# Altium project dsd_badge.PrjPCB
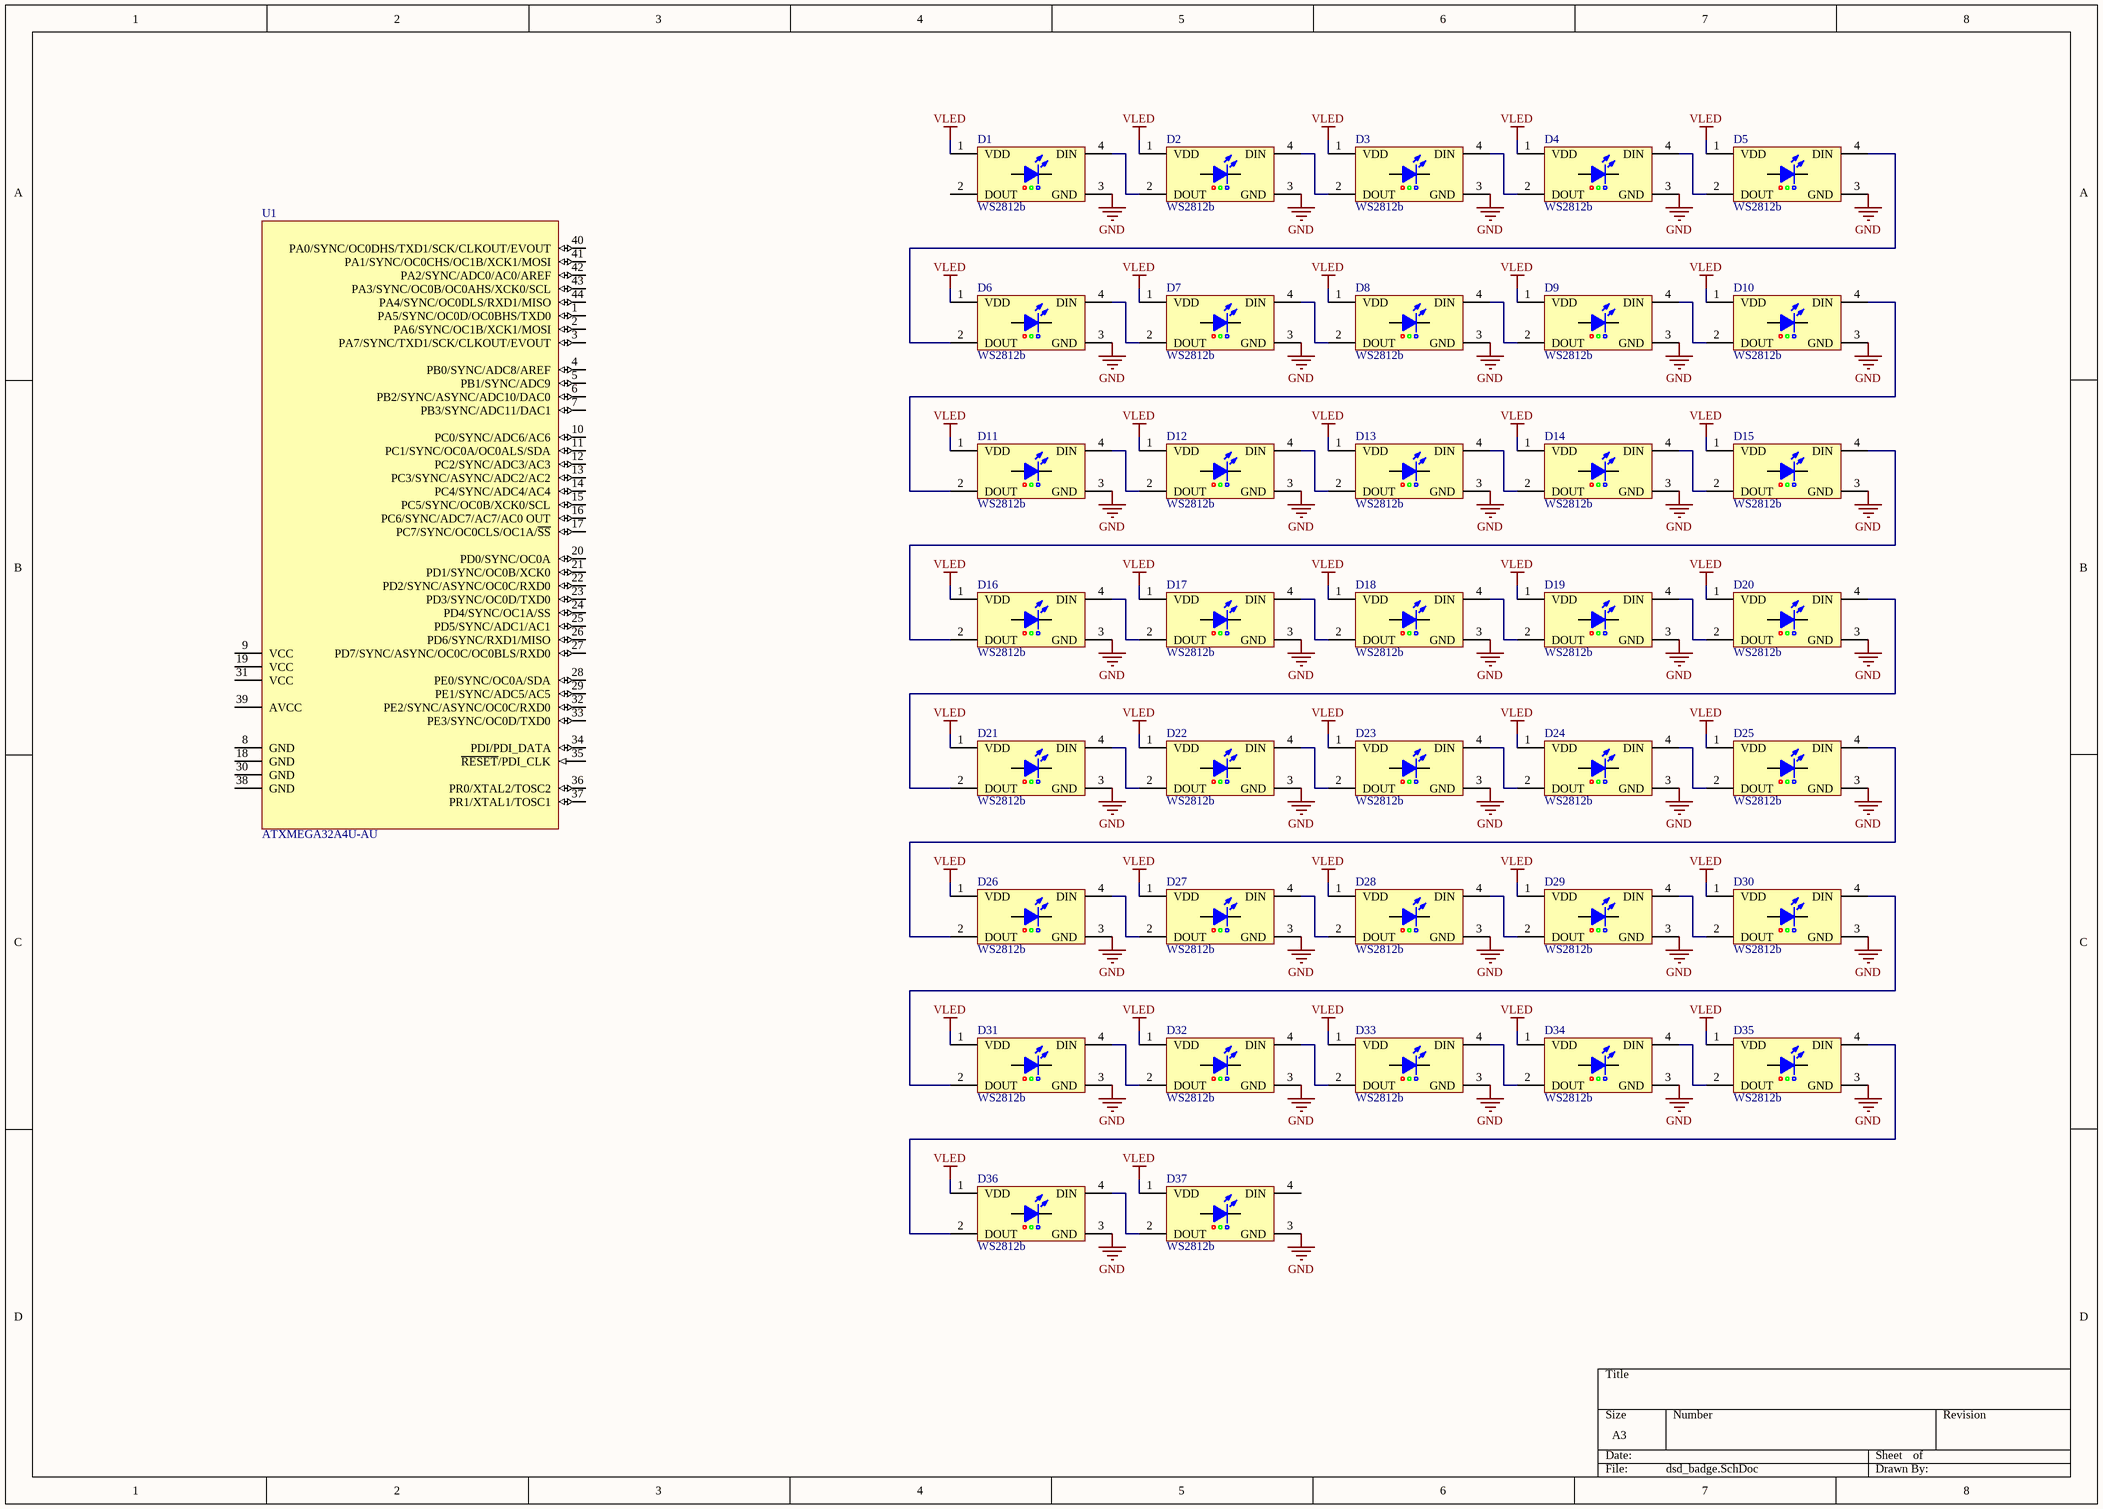
[diagram p0: dsd_badge.SchDoc]
1 sheet, 38 parts. Net scope: global (net labels, ports and power ports of the same name join across sheets).
Board file: DSD_Badge.PcbDoc

## Sheet dsd_badge.SchDoc
size A3

### Parts
D1  WS2812b  [WS2812B]
D2  WS2812b  [WS2812B]
D3  WS2812b  [WS2812B]
D4  WS2812b  [WS2812B]
D5  WS2812b  [WS2812B]
D6  WS2812b  [WS2812B]
D7  WS2812b  [WS2812B]
D8  WS2812b  [WS2812B]
D9  WS2812b  [WS2812B]
D10  WS2812b  [WS2812B]
D11  WS2812b  [WS2812B]
D12  WS2812b  [WS2812B]
D13  WS2812b  [WS2812B]
D14  WS2812b  [WS2812B]
D15  WS2812b  [WS2812B]
D16  WS2812b  [WS2812B]
D17  WS2812b  [WS2812B]
D18  WS2812b  [WS2812B]
D19  WS2812b  [WS2812B]
D20  WS2812b  [WS2812B]
D21  WS2812b  [WS2812B]
D22  WS2812b  [WS2812B]
D23  WS2812b  [WS2812B]
D24  WS2812b  [WS2812B]
D25  WS2812b  [WS2812B]
D26  WS2812b  [WS2812B]
D27  WS2812b  [WS2812B]
D28  WS2812b  [WS2812B]
D29  WS2812b  [WS2812B]
D30  WS2812b  [WS2812B]
D31  WS2812b  [WS2812B]
D32  WS2812b  [WS2812B]
D33  WS2812b  [WS2812B]
D34  WS2812b  [WS2812B]
D35  WS2812b  [WS2812B]
D36  WS2812b  [WS2812B]
D37  WS2812b  [WS2812B]
U1  ATXMEGA32A4U-AU  [44A_L]

### Nets
GND: D1.3(GND) D2.3(GND) D3.3(GND) D4.3(GND) D5.3(GND) D6.3(GND) D7.3(GND) D8.3(GND) D9.3(GND) D10.3(GND) D11.3(GND) D12.3(GND) D13.3(GND) D14.3(GND) D15.3(GND) D16.3(GND) D17.3(GND) D18.3(GND) D19.3(GND) D20.3(GND) D21.3(GND) D22.3(GND) D23.3(GND) D24.3(GND) D25.3(GND) D26.3(GND) D27.3(GND) D28.3(GND) D29.3(GND) D30.3(GND) D31.3(GND) D32.3(GND) D33.3(GND) D34.3(GND) D35.3(GND) D36.3(GND) D37.3(GND)
VLED: D1.1(VDD) D2.1(VDD) D3.1(VDD) D4.1(VDD) D5.1(VDD) D6.1(VDD) D7.1(VDD) D8.1(VDD) D9.1(VDD) D10.1(VDD) D11.1(VDD) D12.1(VDD) D13.1(VDD) D14.1(VDD) D15.1(VDD) D16.1(VDD) D17.1(VDD) D18.1(VDD) D19.1(VDD) D20.1(VDD) D21.1(VDD) D22.1(VDD) D23.1(VDD) D24.1(VDD) D25.1(VDD) D26.1(VDD) D27.1(VDD) D28.1(VDD) D29.1(VDD) D30.1(VDD) D31.1(VDD) D32.1(VDD) D33.1(VDD) D34.1(VDD) D35.1(VDD) D36.1(VDD) D37.1(VDD)
NetD1_4: D1.4(DIN) D2.2(DOUT)
NetD2_4: D2.4(DIN) D3.2(DOUT)
NetD3_4: D3.4(DIN) D4.2(DOUT)
NetD4_4: D4.4(DIN) D5.2(DOUT)
NetD5_4: D5.4(DIN) D6.2(DOUT)
NetD6_4: D6.4(DIN) D7.2(DOUT)
NetD7_4: D7.4(DIN) D8.2(DOUT)
NetD8_4: D8.4(DIN) D9.2(DOUT)
NetD9_4: D9.4(DIN) D10.2(DOUT)
NetD10_4: D10.4(DIN) D11.2(DOUT)
NetD11_4: D11.4(DIN) D12.2(DOUT)
NetD12_4: D12.4(DIN) D13.2(DOUT)
NetD13_4: D13.4(DIN) D14.2(DOUT)
NetD14_4: D14.4(DIN) D15.2(DOUT)
NetD15_4: D15.4(DIN) D16.2(DOUT)
NetD16_4: D16.4(DIN) D17.2(DOUT)
NetD17_4: D17.4(DIN) D18.2(DOUT)
NetD18_4: D18.4(DIN) D19.2(DOUT)
NetD19_4: D19.4(DIN) D20.2(DOUT)
NetD20_4: D20.4(DIN) D21.2(DOUT)
NetD21_4: D21.4(DIN) D22.2(DOUT)
NetD22_4: D22.4(DIN) D23.2(DOUT)
NetD23_4: D23.4(DIN) D24.2(DOUT)
NetD24_4: D24.4(DIN) D25.2(DOUT)
NetD25_4: D25.4(DIN) D26.2(DOUT)
NetD26_4: D26.4(DIN) D27.2(DOUT)
NetD27_4: D27.4(DIN) D28.2(DOUT)
NetD28_4: D28.4(DIN) D29.2(DOUT)
NetD29_4: D29.4(DIN) D30.2(DOUT)
NetD30_4: D30.4(DIN) D31.2(DOUT)
NetD31_4: D31.4(DIN) D32.2(DOUT)
NetD32_4: D32.4(DIN) D33.2(DOUT)
NetD33_4: D33.4(DIN) D34.2(DOUT)
NetD34_4: D34.4(DIN) D35.2(DOUT)
NetD35_4: D35.4(DIN) D36.2(DOUT)
NetD36_4: D36.4(DIN) D37.2(DOUT)

Not connected (* = marked no-connect by the designer): D1 2(DOUT); D37 4(DIN); U1 1(PA5/SYNC/OC0D/OC0BHS/TXD0) 2(PA6/SYNC/OC1B/XCK1/MOSI) 3(PA7/SYNC/TXD1/SCK/CLKOUT/EVOUT) 4(PB0/SYNC/ADC8/AREF) 5(PB1/SYNC/ADC9) 6(PB2/SYNC/ASYNC/ADC10/DAC0) 7(PB3/SYNC/ADC11/DAC1) 8(GND) 9(VCC) 10(PC0/SYNC/ADC6/AC6) 11(PC1/SYNC/OC0A/OC0ALS/SDA) 12(PC2/SYNC/ADC3/AC3) 13(PC3/SYNC/ASYNC/ADC2/AC2) 14(PC4/SYNC/ADC4/AC4) 15(PC5/SYNC/OC0B/XCK0/SCL) 16(PC6/SYNC/ADC7/AC7/AC0_OUT) 17(PC7/SYNC/OC0CLS/OC1A/~{SS}) 18(GND) 19(VCC) 20(PD0/SYNC/OC0A) 21(PD1/SYNC/OC0B/XCK0) 22(PD2/SYNC/ASYNC/OC0C/RXD0) 23(PD3/SYNC/OC0D/TXD0) 24(PD4/SYNC/OC1A/SS) 25(PD5/SYNC/ADC1/AC1) 26(PD6/SYNC/RXD1/MISO) 27(PD7/SYNC/ASYNC/OC0C/OC0BLS/RXD0) 28(PE0/SYNC/OC0A/SDA) 29(PE1/SYNC/ADC5/AC5) 30(GND) 31(VCC) 32(PE2/SYNC/ASYNC/OC0C/RXD0) 33(PE3/SYNC/OC0D/TXD0) 34(PDI/PDI_DATA) 35(~{RESET}/PDI_CLK) 36(PR0/XTAL2/TOSC2) 37(PR1/XTAL1/TOSC1) 38(GND) 39(AVCC) 40(PA0/SYNC/OC0DHS/TXD1/SCK/CLKOUT/EVOUT) 41(PA1/SYNC/OC0CHS/OC1B/XCK1/MOSI) 42(PA2/SYNC/ADC0/AC0/AREF) 43(PA3/SYNC/OC0B/OC0AHS/XCK0/SCL) 44(PA4/SYNC/OC0DLS/RXD1/MISO)

### Library data of the parts
D1-D37 = WS2812b: ADDRESS LED DISCR SER RGB 1=10; Manufacturer: Adafruit Industries; Manufacturer Part Number: 1655; Color: Blue,Green,Red; Number of LEDs: 10; Supplier 1: Digi-Key; Stock 1: 3911; Pricing 1: 1=4.5 (USD); Mount: Surface Mount; Length: 5mm; Width: 5mm; ComponentLink1URL: https://cdn-shop.adafruit.com/product-files/1138/SK6812+LED+datasheet+.pdf?src-supplier=Digi-Key; ComponentLink1Description: https://cdn-shop.adafruit.com/product-files/1138/SK6812+LED+datasheet+.pdf?src-supplier=Digi-Key; ComponentLink2URL: http://www.mouser.com/ds/2/737/SK6812_LED_datasheet_-953546.pdf?src-supplier=Mouser; ComponentLink2Description: http://www.mouser.com/ds/2/737/SK6812_LED_datasheet_-953546.pdf?src-supplier=Mouser; Supplier Part Number 1: 1528-1104-ND
U1 = ATXMEGA32A4U-AU: IC MCU 8BIT 32KB FLASH 44TQFP; Manufacturer: Atmel; Core Processor: AVR; Core Size: 8/16-Bit; Speed: 32MHz; Connectivity: I²C, IrDA, SPI, UART/USART, USB; Peripherals: Brown-out Detect/Reset, DMA, POR, PWM, WDT; Number of I /O: 34; Program Memory Size: 32KB (16K x 16); EEPROM Size: 2K x 8; RAM Size: 4K x 8; Voltage - Supply (Vcc/Vdd): 1.6 V ~ 3.6 V; Data Converters: A/D 12x12b, D/A 2x12b; Oscillator Type: Internal; Supplier 1: Digi-Key; RoHS: RoHS Compliant; Category: Integrated Circuits (ICs); Stock 1: 2077; Pricing 1: 1=3.43, 25=2.1548, 100=1.9152 (USD); Packaging: Tray; Program Memory Type: FLASH; Operating Temperature: -40°C ~ 85°C; Package / Case: 44-TQFP; ComponentLink1URL: http://www.atmel.com/Images/Atmel-8387-8-and16-bit-AVR-Microcontroller-XMEGA-A4U_Datasheet.pdf; ComponentLink1Description: http://www.atmel.com/Images/Atmel-8387-8-and16-bit-AVR-Microcontroller-XMEGA-A4U_Datasheet.pdf; Supplier Part Number 1: ATXMEGA32A4U-AU-ND; Manufacturer Part Number: ATXMEGA32A4U-AU